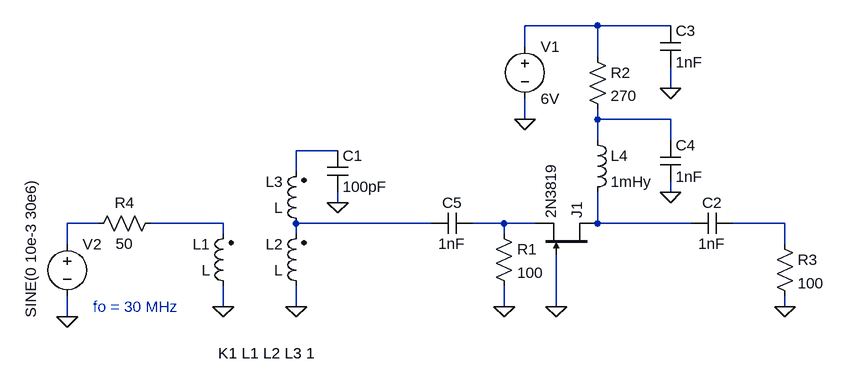
[diagram p0: schematic 10_5_21.asc]
10_5_21.asc, the LTspice schematic file:
Version 4
SHEET 1 980 680
WIRE 624 -160 512 -160
WIRE 736 -160 624 -160
WIRE 512 -128 512 -160
WIRE 624 -112 624 -160
WIRE 736 -64 736 -96
WIRE 512 -16 512 -48
WIRE 624 -16 624 -32
WIRE 736 -16 624 -16
WIRE 624 16 624 -16
WIRE 736 16 736 -16
WIRE 224 32 160 32
WIRE 160 64 160 32
WIRE 736 96 736 80
WIRE 224 112 224 96
WIRE -144 144 -192 144
WIRE 48 144 -64 144
WIRE 368 144 160 144
WIRE 480 144 432 144
WIRE 528 144 480 144
WIRE 624 144 624 96
WIRE 768 144 624 144
WIRE 912 144 832 144
WIRE 48 160 48 144
WIRE 160 160 160 144
WIRE 480 160 480 144
WIRE -192 176 -192 144
WIRE 912 176 912 144
WIRE 48 272 48 240
WIRE 160 272 160 240
WIRE 480 272 480 240
WIRE 560 272 560 192
WIRE 912 272 912 256
WIRE -192 288 -192 256
FLAG 48 272 0
FLAG 160 272 0
FLAG 224 112 0
FLAG 480 272 0
FLAG 560 272 0
FLAG 512 -16 0
FLAG 736 -64 0
FLAG 736 96 0
FLAG 912 272 0
FLAG -192 288 0
SYMBOL ind2 64 256 R180
WINDOW 0 36 80 Left 2
WINDOW 3 36 40 Left 2
SYMATTR InstName L1
SYMATTR Type ind
SYMBOL ind2 176 256 R180
WINDOW 0 36 80 Left 2
WINDOW 3 36 40 Left 2
SYMATTR InstName L2
SYMATTR Type ind
SYMBOL cap 208 32 R0
SYMATTR InstName C1
SYMATTR Value 100pF
SYMBOL ind2 176 160 R180
WINDOW 0 36 80 Left 2
WINDOW 3 36 40 Left 2
SYMATTR InstName L3
SYMATTR Type ind
SYMBOL cap 832 128 R90
WINDOW 0 0 32 VBottom 2
WINDOW 3 32 32 VTop 2
SYMATTR InstName C2
SYMATTR Value 1nF
SYMBOL res 464 144 R0
SYMATTR InstName R1
SYMATTR Value 100
SYMBOL njf 624 192 M270
SYMATTR InstName J1
SYMATTR Value 2N3819
SYMBOL ind 608 0 R0
SYMATTR InstName L4
SYMATTR Value 1mHy
SYMBOL voltage 512 -144 R0
SYMATTR InstName V1
SYMATTR Value 6V
SYMBOL cap 720 -160 R0
SYMATTR InstName C3
SYMATTR Value 1nF
SYMBOL cap 720 16 R0
SYMATTR InstName C4
SYMATTR Value 1nF
SYMBOL res 608 -128 R0
SYMATTR InstName R2
SYMATTR Value 270
SYMBOL cap 432 128 R90
WINDOW 0 0 32 VBottom 2
WINDOW 3 32 32 VTop 2
SYMATTR InstName C5
SYMATTR Value 1nF
SYMBOL res 896 160 R0
SYMATTR InstName R3
SYMATTR Value 100
SYMBOL res -48 128 R90
WINDOW 0 0 56 VBottom 2
WINDOW 3 32 56 VTop 2
SYMATTR InstName R4
SYMATTR Value 50
SYMBOL voltage -192 160 R0
WINDOW 3 -56 130 VLeft 2
WINDOW 123 0 0 Left 0
WINDOW 39 0 0 Left 0
SYMATTR InstName V2
SYMATTR Value SINE(0 10e-3 30e6)
TEXT 40 344 Left 2 !K1 L1 L2 L3 1
TEXT -152 272 Left 2 ;fo = 30 MHz

The netlist it stands for:
* 10_5_21.asc
L1 0 N005 L
L2 0 N006 L
C1 N003 0 100pF
L3 N006 N003 L
C2 N009 N008 1nF
R1 N007 0 100
J1 N008 0 N007 2N3819
L4 N002 N008 1mHy
V1 N001 0 6V
C3 N001 0 1nF
C4 N002 0 1nF
R2 N001 N002 270
C5 N007 N006 1nF
R3 N009 0 100
R4 N005 N004 50
V2 N004 0 SINE(0 10e-3 30e6)
.model NJF NJF
.model PJF PJF
.lib standard.jft
K1 L1 L2 L3 1
* fo = 30 MHz
.backanno
.end